# EAGLE design ChakraPendantLEDs (EAGLE 7.2.0)
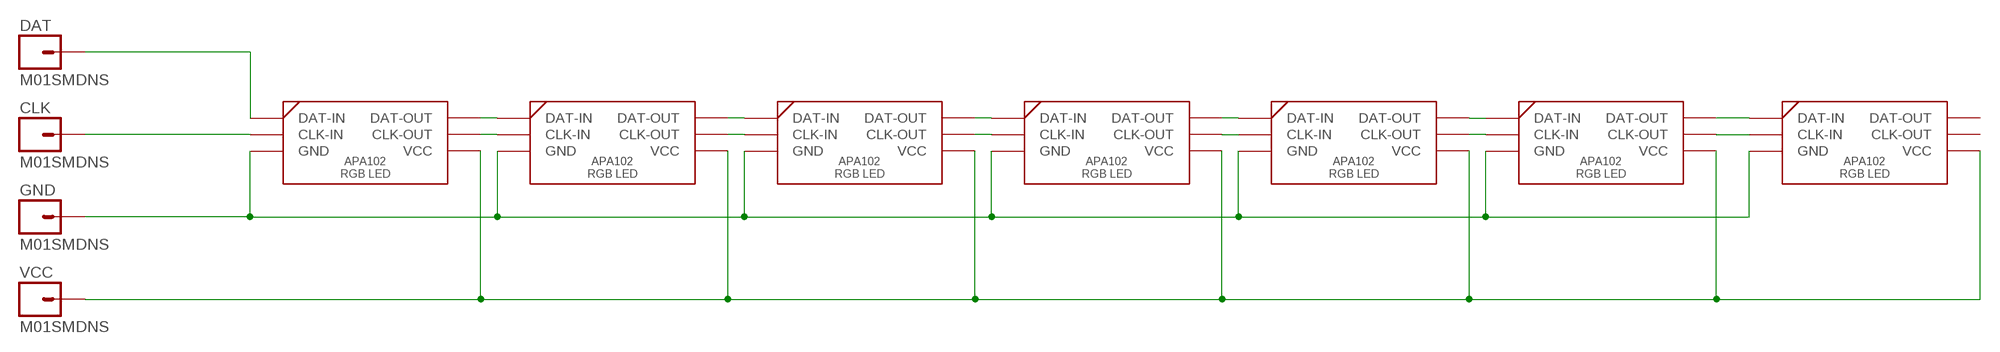
[diagram p0: schematic, sheet 1]

## Parts
CLK  M01SMDNS  [1X01NS]
DAT  M01SMDNS  [1X01NS]
GND  M01SMDNS  [1X01NS]
U$1  APA102  [APA102_5050_LED]
U$2  APA102  [APA102_5050_LED]
U$3  APA102  [APA102_5050_LED]
U$4  APA102  [APA102_5050_LED]
U$5  APA102  [APA102_5050_LED]
U$6  APA102  [APA102_5050_LED]
U$7  APA102  [APA102_5050_LED]
VCC  M01SMDNS  [1X01NS]

## Nets
CLK: CLK.1 U$1.CLK-IN
DAT: DAT.1 U$1.DAT-IN
GND: GND.1 U$1.GND U$2.GND U$3.GND U$4.GND U$5.GND U$6.GND U$7.GND
N$1: U$3.CLK-OUT U$4.CLK-IN
N$2: U$3.DAT-OUT U$4.DAT-IN
N$3: U$1.DAT-OUT U$2.DAT-IN
N$4: U$1.CLK-OUT U$2.CLK-IN
N$5: U$2.DAT-OUT U$3.DAT-IN
N$6: U$2.CLK-OUT U$3.CLK-IN
N$7: U$4.CLK-OUT U$5.CLK-IN
N$8: U$4.DAT-OUT U$5.DAT-IN
N$9: U$5.DAT-OUT U$6.DAT-IN
N$10: U$5.CLK-OUT U$6.CLK-IN
N$11: U$6.CLK-OUT U$7.CLK-IN
N$12: U$6.DAT-OUT U$7.DAT-IN
VCC: U$1.VCC U$2.VCC U$3.VCC U$4.VCC U$5.VCC U$6.VCC U$7.VCC VCC.1
Unconnected: U$7.CLK-OUT U$7.DAT-OUT

## Library data of the parts
CLK DAT GND VCC = SparkFun-Connectors:M01: Header 1 Standard 1-pin 0.1" header. Use with straight break away headers (SKU : PRT-00116), right angle break away headers (PRT-00553), swiss pins (PRT-00743), machine pins (PRT-00117), and female headers (PRT-00115).
U$1-U$7 = SqueegyLib:APA102

## Net classes
0 default: width 0.406 mm

## Board
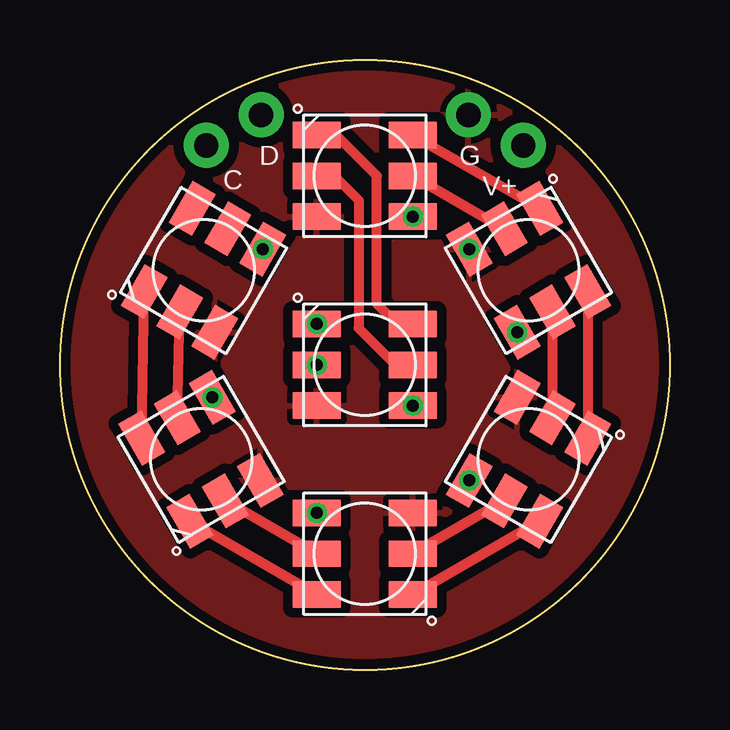
[diagram p1: board, top side]
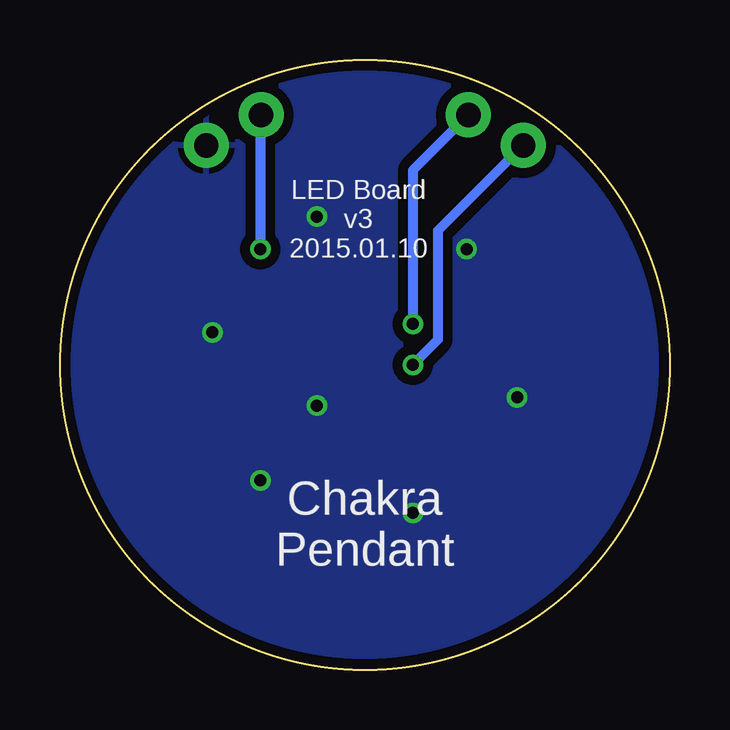
[diagram p2: board, bottom side, seen from below]

Size 25.4 x 25.4 mm. Coordinates in mm from the lower left corner, seen from the top.
Outline: circle at 12.7,12.7 radius 12.7
Copper layers (1*16): Top 0.0356mm / dielectric 1.5011mm / Bottom 0.0356mm
Design rules "oshpark-2layer *": minimum track width 6mil, minimum drill 13mil, track to track 6mil, track to pad 6mil, pad to pad 6mil, via to via 6mil, smd to smd 6mil, copper to edge 15mil, drill to drill 6mil, minimum pad ring 7mil, minimum via ring 7mil, stop-mask expansion 4mil, vias tented up to drill 20mil, thermal gap 10mil

### Footprints (pad centres in the part's own frame; a part is rotated, then mirrored left to right if it is on the bottom)
1X01NS = drill 1.016 pad 1.88: 1 0,0
APA102_5050_LED = smd 2 x 1.1: CLK-IN -2,0; CLK-OUT 2,0; DAT-IN -2,1.7; DAT-OUT 2,1.7; GND -2,-1.7; VCC 2,-1.7

### Placement (x,y rotation side)
CLK  6.1,21.84 0 top
DAT  8.38,23.11 0 top
GND  17.02,23.11 0 top
U$1  12.7,12.7 0 top
U$2  12.7,20.57 0 top
U$3  19.52,16.64 300 top
U$4  19.52,8.76 240 top
U$5  12.7,4.83 180 top
U$6  5.88,8.76 120 top
U$7  5.98,16.64 60 top
VCC  19.3,21.84 0 top

### Tracks (layer width: path | path; a pad name or v marks a point on that pad's centre or on a via)
CLK  (via drill 0.5)
  Bottom 0.406: CLK.1 9.65,18.29 9.65,13.75 U$1.CLK-IN
  other vias: 10.7,12.7
DAT  (via drill 0.5)
  Bottom 0.406: DAT.1 10.7,20.8 U$1.DAT-IN
  other vias: 10.7,14.4
GND  (via drill 0.5)
  Bottom 0.406: GND.1 17.05,23.11 U$3.GND
  other vias: 17.05,17.52
  pour Top (isolate 0.406): 0,25.4 25.4,25.4 25.4,0 0,0
N$1
  Top 0.406: U$3.CLK-OUT U$4.CLK-IN
N$2
  Top 0.406: U$3.DAT-OUT U$4.DAT-IN
N$3
  Top 0.406: U$2.DAT-IN 11.51,22.27 13.21,20.57 13.21,15.24 14.05,14.4 U$1.DAT-OUT
N$4
  Top 0.406: U$2.CLK-IN 11.43,20.57 12.45,19.56 12.45,14.22 13.97,12.7 U$1.CLK-OUT
N$5
  Top 0.406: U$2.DAT-OUT U$3.DAT-IN
N$6
  Top 0.406: U$2.CLK-OUT U$3.CLK-IN
N$7
  Top 0.406: U$4.CLK-OUT U$5.CLK-IN
N$8
  Top 0.406: U$4.DAT-OUT U$5.DAT-IN
N$9
  Top 0.406: U$5.DAT-OUT U$6.DAT-IN
N$10
  Top 0.406: U$5.CLK-OUT U$6.CLK-IN
N$11
  Top 0.406: U$6.CLK-OUT U$7.CLK-IN
N$12
  Top 0.406: U$6.DAT-OUT U$7.DAT-IN
VCC  (via drill 0.5)
  other vias: 17.05,7.88 19.05,14.05 14.7,18.87 14.7,11 10.7,6.53 8.45,17.52 6.35,11.35
  pour Bottom (isolate 0.406): 0,25.4 25.4,25.4 25.4,0 0,0

### Text on the board
bPlace: LED Board / v3 / 2015.01.10
tNames: D | G | C | V+
bNames: Chakra / Pendant